# EAGLE design power charger phone 2A (EAGLE 9.6.2)
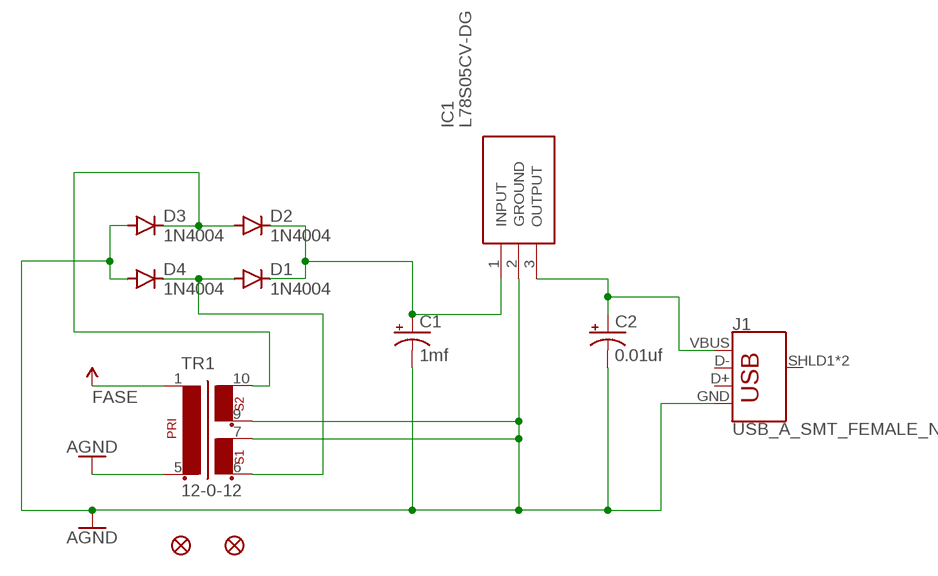
[diagram p0: schematic, sheet 1]

## Parts
C1  1mf  1000UF-RADIAL-5MM-35V-20%-KIT  [CPOL-RADIAL-5MM-10MM-KIT]
C2  0.01uf  1000UF-RADIAL-5MM-35V-20%-KIT  [CPOL-RADIAL-5MM-10MM-KIT]
D1  1N4004  [DO41-10]
D2  1N4004  [DO41-10]
D3  1N4004  [DO41-10]
D4  1N4004  [DO41-10]
FD1  FIDUCIAL1X2  [FIDUCIAL-1X2]
FD2  FIDUCIAL1X2  [FIDUCIAL-1X2]
IC1  L78S05CV-DG  [TO270P460X1020X2008-3P]
J1  USB_A_SMT_FEMALE_NS  [USB-A-S-NOSILK-FEMALE]
TR1  12-0-12  EI30-2  [EI30-2]

## Nets
AGND: C1.- C2.- D3.A D4.A IC1.2(GROUND) J1.GND TR1.5 TR1.7 TR1.9
FASE: TR1.1 ; supply symbol labelled VCC
N$1: C2.+ IC1.3(OUTPUT) J1.VBUS
N$2: D2.A D3.C TR1.10
N$3: D1.A D4.C TR1.6
N$4: C1.+ D1.C D2.C IC1.1(INPUT)
Unconnected: J1.D+ J1.D- J1.SHLD1(SHIELD) J1.SHLD2(SHIELD)

## Library data of the parts
C1 = SparkFun-Capacitors:1000UF: 1,000µF/1mF ceramic capacitors A capacitor is a passive two-terminal electrical component used to store electrical energy temporarily in an electric field. CAP-08070; PROD_ID: CAP-09538
C2 = SparkFun-Capacitors:1000UF: 1,000µF/1mF ceramic capacitors A capacitor is a passive two-terminal electrical component used to store electrical energy temporarily in an electric field. CAP-08070; PROD_ID: CAP-09538; VALUE: 1mf
D1-D4 = diode:1N4004: DIODE general purpose rectifier, 1 A
FD1 FD2 = SparkFun-Aesthetics:FIDUCIAL: Fiducial Alignment Points Point-of-reference for pick-and-place machines and other optical instruments.
IC1 = SamacSys_Parts:L78S05CV-DG: Linear Voltage Regulators 2A Positive Reg 7.9V Output 5V DG Source: Datasheet <https://datasheet.datasheetarchive.com/originals/distributors/Datasheets-DGA25/1774459.pdf>; ARROW_PART_NUMBER: L78S05CV-DG; ARROW_PRICE-STOCK: https://www.arrow.com/en/products/l78s05cv-dg/stmicroelectronics; DESCRIPTION: Linear Voltage Regulators 2A Positive Reg 7.9V Output 5V DG; HEIGHT: 4.6mm; MANUFACTURER_NAME: STMicroelectronics; MANUFACTURER_PART_NUMBER: L78S05CV-DG; MOUSER_PART_NUMBER: 511-L78S05CV-DG; MOUSER_PRICE-STOCK: https://www.mouser.co.uk/ProductDetail/STMicroelectronics/L78S05CV-DG?qs=UOUhb9503hFQHy635AeyYA%3D%3D
J1 = SparkFun-Connectors:USB_A: USB-A Connector Male and female variants, as well as PTH and SMT variants SparkFun Products: SparkFun XBee Explorer Dongle <https://www.sparkfun.com/products/11697> PTH Male SparkFun MicroView-USB Programmer <https://www.sparkfun.com/products/12924> SMT Male SparkFun USB Type A Female Breakout <https://www.sparkfun.com/products/12700> SMT Female; PROD_ID: CONN-09520; SF_ID: PRT-09011
TR1 = trafo:EI30-2: TRANSFORMER 1 primary winding, 2 secondary windings ERA; SPICEPREFIX: T

## Board
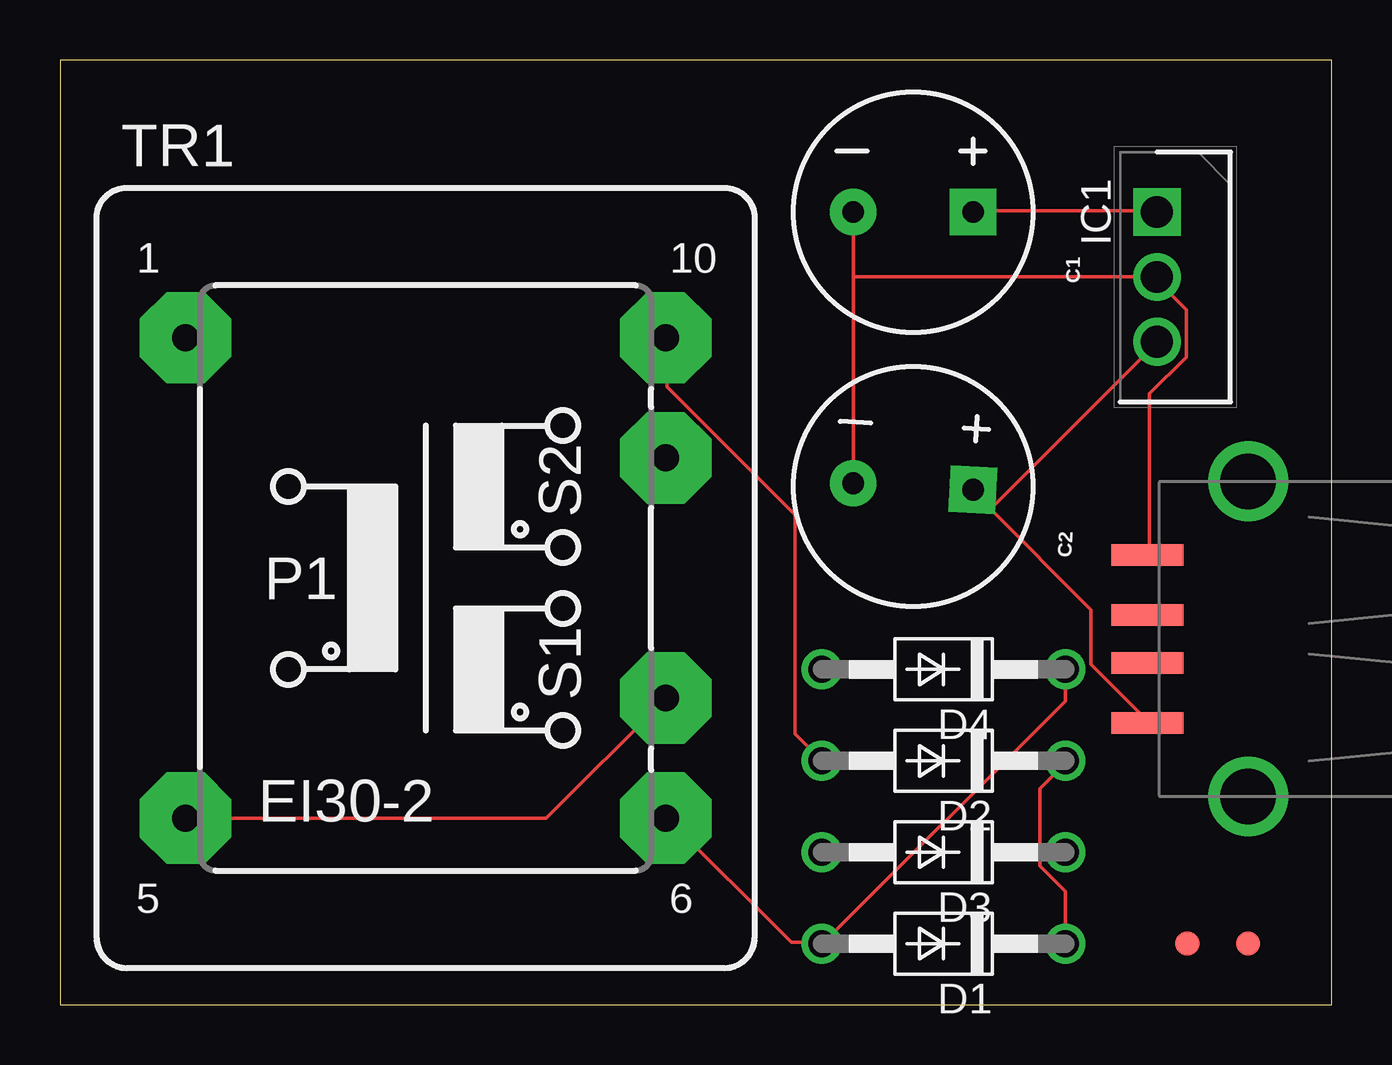
[diagram p1: board, top side]
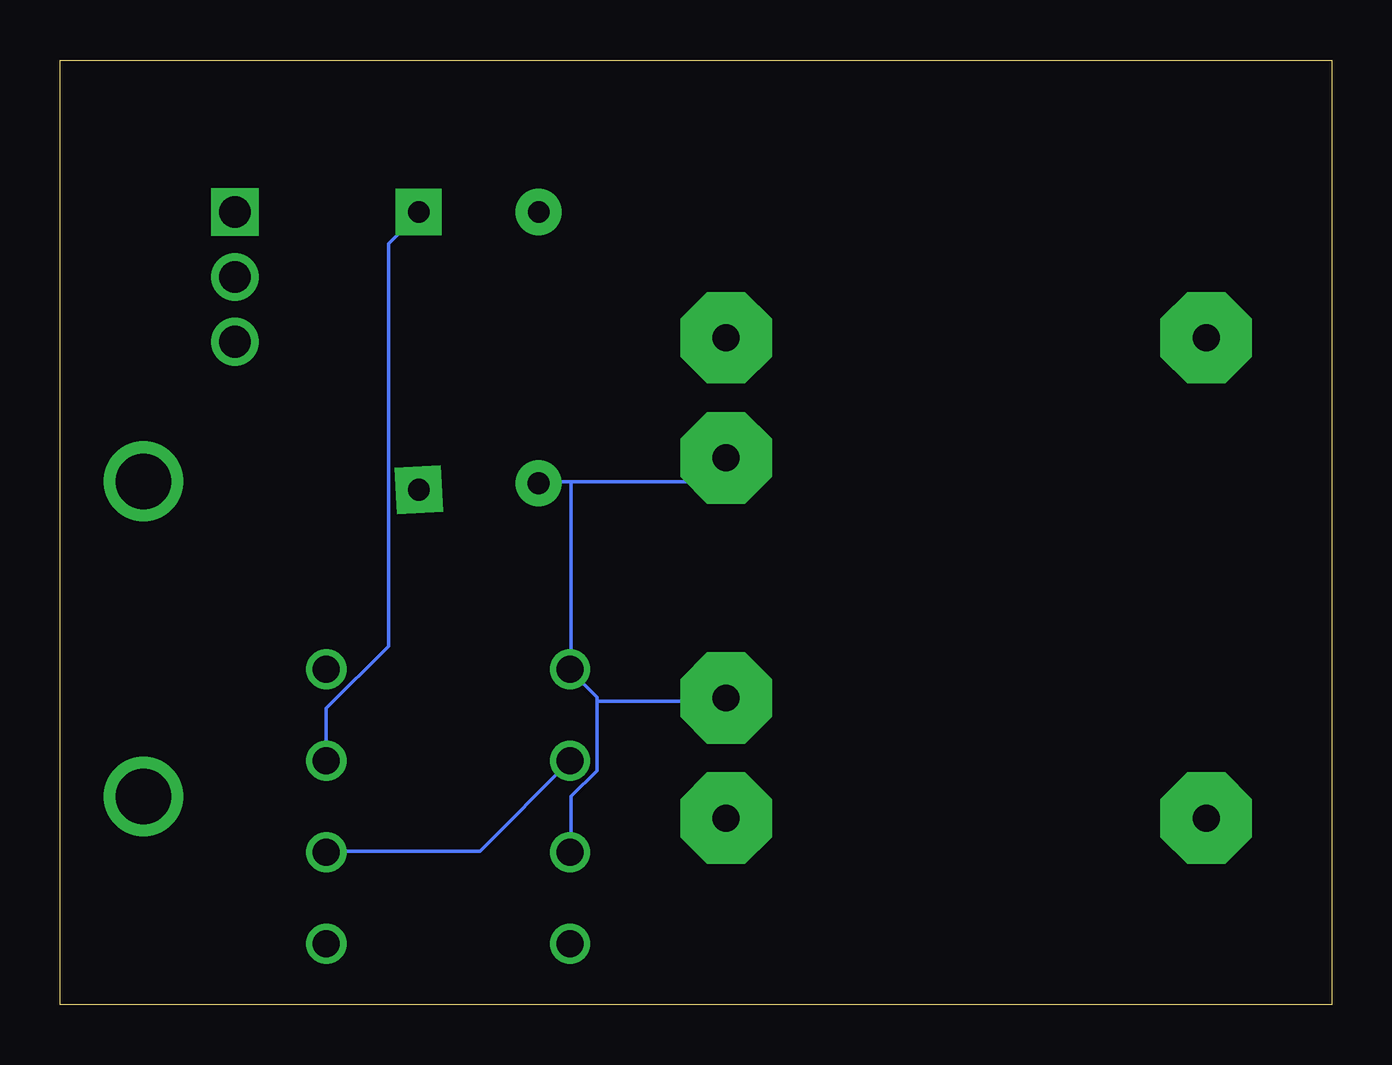
[diagram p2: board, bottom side, seen from below]

Size 53.01 x 39.36 mm. Coordinates in mm from the lower left corner, seen from the top.
Outline: 0,0 53.01,0 53.01,39.36 0,39.36 0,0
Copper layers (1*16): Top 0.035mm / dielectric 1.5mm / Bottom 0.035mm
Design rules "default": minimum track width 6mil, minimum drill 0.35mm, track to track 6mil, track to pad 6mil, pad to pad 6mil, via to via 6mil, smd to smd 6mil, copper to edge 40mil, drill to drill 6mil, minimum pad ring 10mil, minimum via ring 8mil, stop-mask expansion 4mil, vias tented up to drill 0mil, thermal gap 10mil

### Footprints (pad centres in the part's own frame; a part is rotated, then mirrored left to right if it is on the bottom)
CPOL-RADIAL-5MM-10MM-KIT = drill 0.9 pad 1.93 square: + 2.5,0 | drill 0.9 pad 1.93: - -2.5,0
DO41-10 = drill 1.118: A 5.08,0; C -5.08,0
FIDUCIAL-1X2 = smd 1 x 1: 1 0,0
TO270P460X1020X2008-3P = drill 1.32 pad 1.98 square: 1 0,0 | drill 1.32 pad 1.98: 2 2.7,0; 3 5.4,0
USB-A-S-NOSILK-FEMALE = smd 3 x 0.9: D+ 6.752,-1; D- 6.752,1; GND 6.752,-3.5; VBUS 6.752,3.5 | drill 2.311: SHLD1 2.54,-6.566; SHLD2 2.54,6.566
EI30-2 = drill 1.118 pad 3.81 octagon: 1 -10.008,10.008; 5 -10.008,-10.008; 6 10.008,-10.008; 7 10.008,-5.004; 9 10.008,5.004; 10 10.008,10.008

### Placement (x,y rotation side)
C1  35.56,33.02 0 top
C2  35.56,21.59 356.9 top
D1  36.83,2.54 180 top
D2  36.83,10.16 180 top
D3  36.83,6.35 180 top
D4  36.83,13.97 180 top
FD1  46.99,2.54 0 top
FD2  49.53,2.54 0 top
IC1  45.72,33.02 270 top
J1  52.07,15.24 180 top
TR1  15.24,17.78 0 top

### Tracks (layer width: path | path; a pad name or v marks a point on that pad's centre or on a via)
AGND
  Top 0.152: 45.26,18.69 J1.GND | 45.36,18.75 J1.GND | J1.GND 45.41,18.75 45.41,25.45 46.94,26.98 46.94,28.96 45.72,30.18 IC1.2 33.07,30.33 | 33.07,30.33 33.07,21.79 C2.- | 33.07,30.33 33.07,32.92 C1.- | TR1.5 20.27,7.77 25.15,12.65 TR1.7
  Bottom 0.152: 31.7,21.79 26.21,21.79 25.3,22.71 TR1.9 | 31.7,21.79 32.92,21.79 C2.- | 30.63,12.65 30.63,12.8 31.7,13.87 D4.A 31.7,14.02 31.7,21.79 | 30.63,12.65 30.63,9.75 31.7,8.69 31.7,6.4 D3.A | 30.63,12.65 25.3,12.65 TR1.7
N$1
  Top 0.152: 45.26,11.84 J1.VBUS | 45.21,11.89 J1.VBUS | 38.71,20.73 38.1,21.34 C2.+ 38.71,20.73 | 38.71,20.73 42.98,16.46 42.98,14.17 45.26,11.89 J1.VBUS | 38.71,20.73 38.86,20.73 45.72,27.58 IC1.3
N$2
  Top 0.152: D2.A 30.63,11.28 30.63,20.42 25.3,25.76 25.3,27.74 TR1.10
  Bottom 0.152: D2.A 35.51,6.4 41.91,6.4 D3.C
N$3
  Top 0.152: TR1.6 25.3,7.77 30.48,2.59 31.7,2.59 D1.A 31.85,2.59 41.91,12.65 D4.C
  Bottom 0.152: 31.65,2.54 D1.A
N$4
  Top 0.152: D1.C 41.91,4.72 40.84,5.79 40.84,8.99 41.91,10.06 D2.C | C1.+ 38.1,33.07 45.72,33.07 IC1.1
  Bottom 0.152: D2.C 41.91,12.34 39.32,14.94 39.32,31.7 38.1,32.92 C1.+